# EAGLE design pid driver (EAGLE 9.5.1)

## Sheet 1 of 2
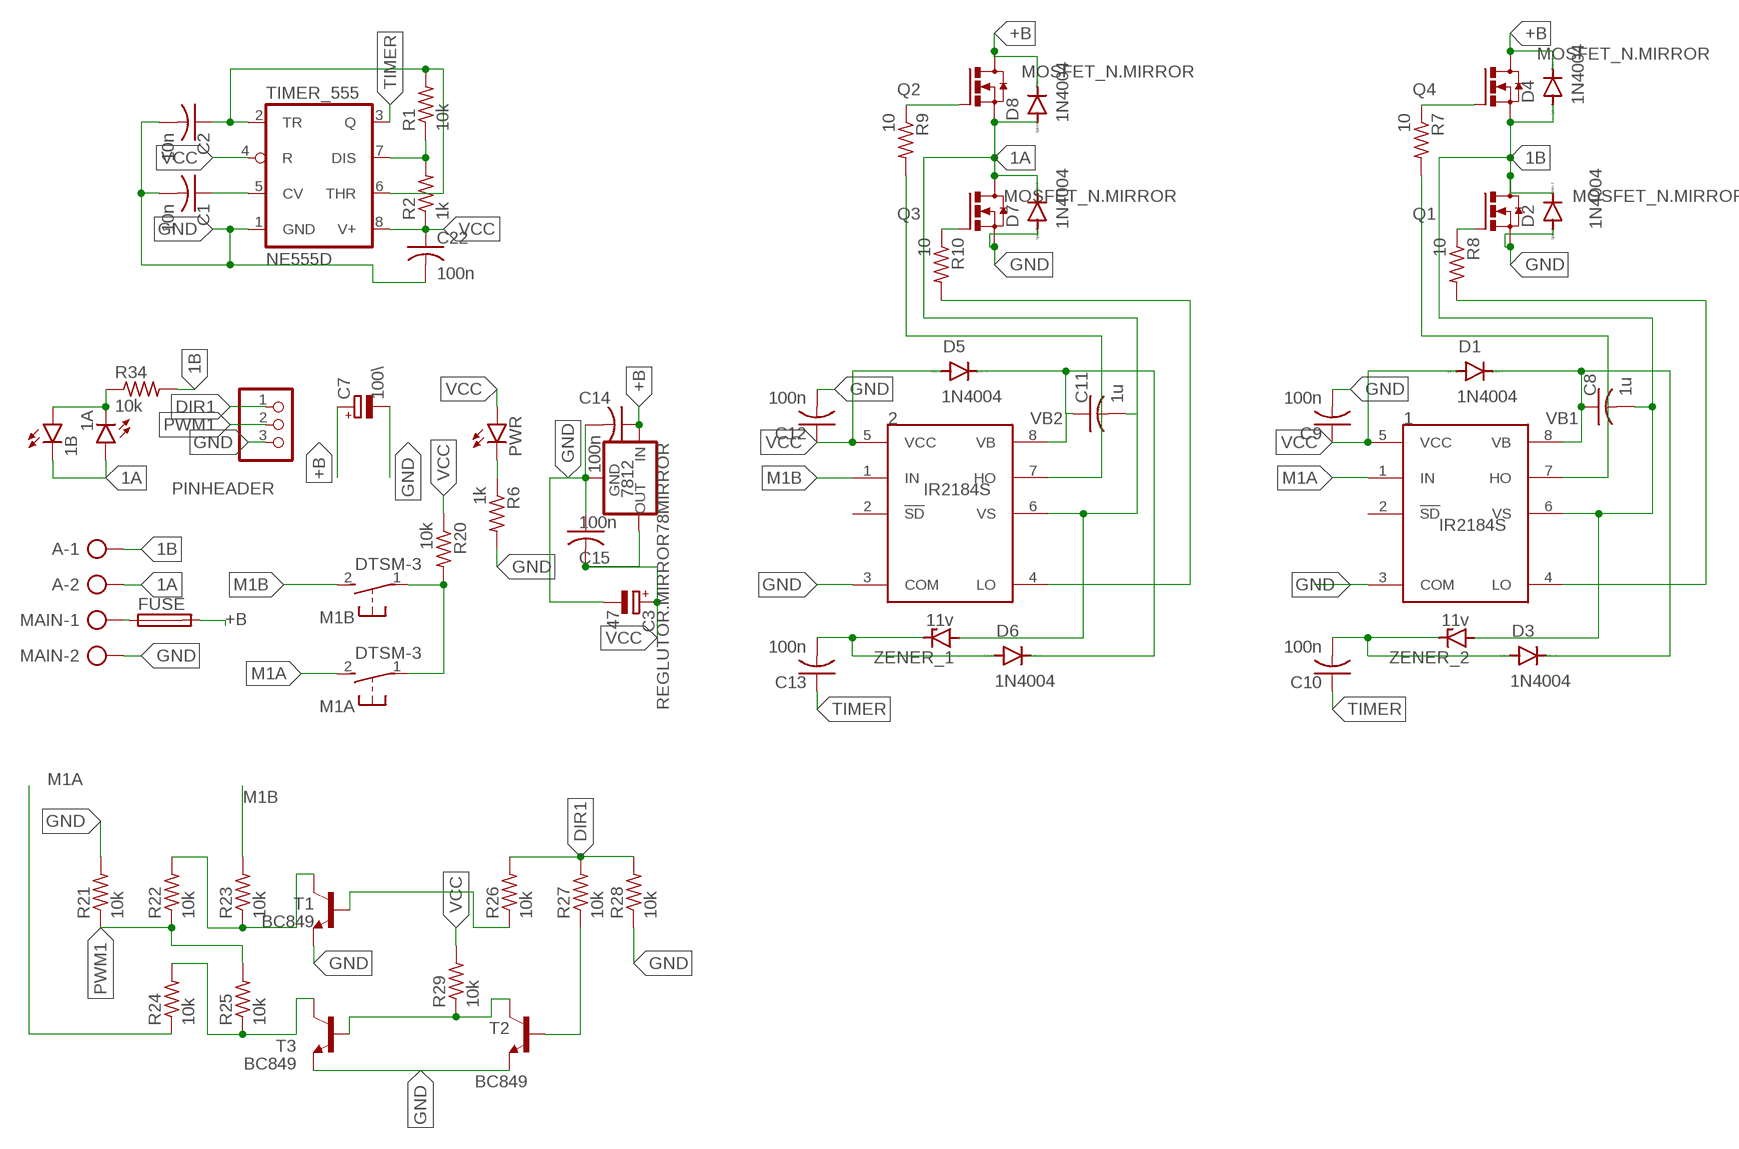
[diagram p0: schematic, sheet 1]

### Parts
1  IR2184S  [SO08]
1A  LEDCHIPLED_1206  [CHIPLED_1206]
1B  LEDCHIPLED_1206  [CHIPLED_1206]
2  IR2184S  [SO08]
7812  REGLUTOR.MIRROR78MIRROR  [78MIRROR]
A  AK300/22  [XTALRR488W60L1090T465H350B]
C1  10n  C-USC1206K  [C1206K]
C2  10n  C-USC1206K  [C1206K]
C3  47  CPOL-EUE5-10.5  [E5-10,5]
C7  100\  CPOL-EUE5-10.5  [E5-10,5]
C8  1u  C-USC1206K  [C1206K]
C9  100n  C-USC1206K  [C1206K]
C10  100n  C-USC1206K  [C1206K]
C11  1u  C-USC1206K  [C1206K]
C12  100n  C-USC1206K  [C1206K]
C13  100n  C-USC1206K  [C1206K]
C14  100n  C-USC1206K  [C1206K]
C15  100n  C-USC1206K  [C1206K]
C22  100n  C-USC1206K  [C1206K]
D1  1N4004  [DO41-10]
D2  1N4004  [DO41-10]
D3  1N4004  [DO41-10]
D4  1N4004  [DO41-10]
D5  1N4004  [DO41-10]
D6  1N4004  [DO41-10]
D7  1N4004  [DO41-10]
D8  1N4004  [DO41-10]
FUSE  FUSE_HOLDER  [SH22,5A]
M1A  DTSM-3  [DTSM-3]
M1B  DTSM-3  [DTSM-3]
MAIN  AK300/22  [XTALRR488W60L1090T465H350B]
PINHEADER  PINHD-1X3  [1X03]
PWR  LEDCHIPLED_1206  [CHIPLED_1206]
Q1  MOSFET_N.MIRROR  [TO220.MIRROR]
Q2  MOSFET_N.MIRROR  [TO220.MIRROR]
Q3  MOSFET_N.MIRROR  [TO220.MIRROR]
Q4  MOSFET_N.MIRROR  [TO220.MIRROR]
R1  10k  R-US_M1206  [M1206]
R2  1k  R-US_M1206  [M1206]
R6  1k  R-US_M1206  [M1206]
R7  10  R-US_M1206  [M1206]
R8  10  R-US_M1206  [M1206]
R9  10  R-US_M1206  [M1206]
R10  10  R-US_M1206  [M1206]
R20  10k  R-US_M1206  [M1206]
R21  10k  R-US_R1206  [R1206]
R22  10k  R-US_R1206  [R1206]
R23  10k  R-US_R1206  [R1206]
R24  10k  R-US_R1206  [R1206]
R25  10k  R-US_R1206  [R1206]
R26  10k  R-US_R1206  [R1206]
R27  10k  R-US_R1206  [R1206]
R28  10k  R-US_R1206  [R1206]
R29  10k  R-US_R1206  [R1206]
R34  10k  R-US_M1206  [M1206]
T1  BC849  [SOT23]
T2  BC849  [SOT23]
T3  BC849  [SOT23]
TIMER_555  NE555D  [SO08]
ZENER_1  11v  BZD23  [SOD81]
ZENER_2  11v  BZD23  [SOD81]

### Nets
1A: 1A.A 1B.C 2.6(VS) A.2 C11.2 D7.C D8.A Q2.S Q3.D ZENER_1.A
1B: 1.6(VS) A.1 C8.2 D2.C D4.A Q1.D Q4.S R34.2 ZENER_2.A
+B: 7812.IN C7.+ C14.1 D4.C D8.C FUSE.2 Q2.D Q4.D
DIR1: PINHEADER.1 R26.2 R27.2 R28.2
GND: 1.3(COM) 2.3(COM) 7812.GND C1.2 C2.2 C3.- C7.- C9.2 C12.2 C14.2 C15.1 C22.2 D2.A D7.A MAIN.2 PINHEADER.3 Q1.S Q3.S R6.2 R21.2 R28.1 T1.2(E) T2.2(E) T3.2(E) TIMER_555.1(GND)
M1A: 1.1(IN) M1A.2 R24.1
M1B: 2.1(IN) M1B.2 R23.2
N$1: PWR.C R6.1
N$2: C1.1 TIMER_555.5(CV)
N$3: R1.1 R2.2 TIMER_555.7(DIS)
N$4: C2.1 R1.2 TIMER_555.2(TR) TIMER_555.6(THR)
N$7: M1A.1 M1B.1 R20.2
N$9: Q4.G R7.1
N$10: Q1.G R8.1
N$12: 1.4(LO) R8.2
N$13: 1.7(HO) R7.2
N$14: C10.2 D3.A ZENER_2.C
N$15: Q3.G R10.1
N$16: Q2.G R9.1
N$17: 2.4(LO) R10.2
N$18: 2.7(HO) R9.2
N$20: C13.2 D6.A ZENER_1.C
N$22: FUSE.1 MAIN.1
N$24: R24.2 R25.1 T3.3(C)
N$25: R22.2 R23.1 T1.3(C)
N$26: R26.1 T1.1(B)
N$27: R29.1 T2.3(C) T3.1(B)
N$28: R27.1 T2.1(B)
N$45: 1A.C 1B.A R34.1
PWM1: PINHEADER.2 R21.1 R22.1 R25.2
TIMER: C10.1 C13.1 TIMER_555.3(Q)
VB1: 1.8(VB) C8.1 D1.C D3.C
VB2: 2.8(VB) C11.1 D5.C D6.C
VCC: 1.5(VCC) 2.5(VCC) 7812.OUT C3.+ C9.1 C12.1 C15.2 C22.1 D1.A D5.A PWR.A R2.1 R20.1 R29.2 TIMER_555.4(R) TIMER_555.8(V+)
Unconnected: 1.2(!SD) 2.2(!SD)

## Sheet 2 of 2

## Library data of the parts
1 2 = irs:IR2184
1A 1B PWR = led:LED: LED OSRAM: - CHIPLED LG R971, LG N971, LY N971, LG Q971, LY Q971, LO R971, LY R971 LH N974, LH R974 LS Q976, LO Q976, LY Q976 LO Q996 - Hyper CHIPLED LW Q18S LB Q993, LB Q99A, LB R99A - SideLED LS A670, LO A670, LY A670, LG A670, LP A670 LB A673, LV A673, LT A673, LW A673 LH A674 LY A675 LS A676, LA A676, LO A676, LY A676, LW A676 LS A679, LY A679, LG A679 - Hyper Micro SIDELED® LS Y876, LA Y876, LO Y876, LY Y876 LT Y87S - SmartLED LW L88C, LW L88S LB L89C, LB L89S, LG L890 LS L89K, LO L89K, LY L89K LS L896, LA L896, LO L896, LY L896 - TOPLED LS T670, LO T670, LY T670, LG T670, LP T670 LSG T670, LSP T670, LSY T670, LOP T670, LYG T670 LG T671, LOG T671, LSG T671 LB T673, LV T673, LT T673, LW T673 LH T674 LS T676, LA T676, LO T676, LY T676, LB T676, LH T676, LSB T676, LW T676 LB T67C, LV T67C, LT T67C, LS T67K, LO T67K, LY T67K, LW E67C LS E67B, LA E67B, LO E67B, LY E67B, LB E67C, LV E67C, LT E67C LW T67C LS T679, LY T679, LG T679 LS T770, LO T770, LY T770, LG T770, LP T770 LB T773, LV T773, LT T773, LW T773 LH T774 LS E675, LA E675, LY E675, LS T675 LS T776, LA T776, LO T776, LY T776, LB T776 LHGB T686 LT T68C, LB T68C - Hyper Mini TOPLED® LB M676 - Mini TOPLED Santana® LG M470 LS M47K, LO M47K, LY M47K Source: http://www.osram.convergy.de LUXEON: - LUMILED® LXK2-PW12-R00, LXK2-PW12-S00, LXK2-PW14-U00, LXK2-PW14-V00 LXK2-PM12-R00, LXK2-PM12-S00, LXK2-PM14-U00 LXK2-PE12-Q00, LXK2-PE12-R00, LXK2-PE12-S00, LXK2-PE14-T00, LXK2-PE14-U00 LXK2-PB12-K00, LXK2-PB12-L00, LXK2-PB12-M00, LXK2-PB14-N00, LXK2-PB14-P00, LXK2-PB14-Q00 LXK2-PR12-L00, LXK2-PR12-M00, LXK2-PR14-Q00, LXK2-PR14-R00 LXK2-PD12-Q00, LXK2-PD12-R00, LXK2-PD12-S00 LXK2-PH12-R00, LXK2-PH12-S00 LXK2-PL12-P00, LXK2-PL12-Q00, LXK2-PL12-R00 Source: www.luxeon.com KINGBRIGHT: KA-3528ASYC Source: www.kingbright.com
7812 = MOSFET MIRROR:REGLUTOR.MIRROR
A MAIN = con-ptr50056:AK300/2: CONNECTOR
C1 C2 C8-C15 C22 = rcl:C-US: CAPACITOR, American symbol; SPICEPREFIX: C
C3 C7 = rcl8:CPOL-EU: POLARIZED CAPACITOR, European symbol; SPICEPREFIX: C
D1-D8 = diode:1N4004: DIODE general purpose rectifier, 1 A
FUSE = MIA_LIBRARY (2):FUSE_HOLDER
M1A M1B = switch-tact:DTSM-3
PINHEADER = pinhead:PINHD-1X3: PIN HEADER
Q1-Q4 = MIA_LIBRARY (5):MOSFET_N.MIRROR
R1 R2 R6-R10 R20-R29 R34 = rcl:R-US_: RESISTOR, American symbol; SPICEPREFIX: R
T1-T3 = transistor-neu-to92:BC849: NPN TRANSISTOR
TIMER_555 = linear:*555: TIMER
ZENER_1 ZENER_2 = diode:BZD23: Z DIODE

## Board
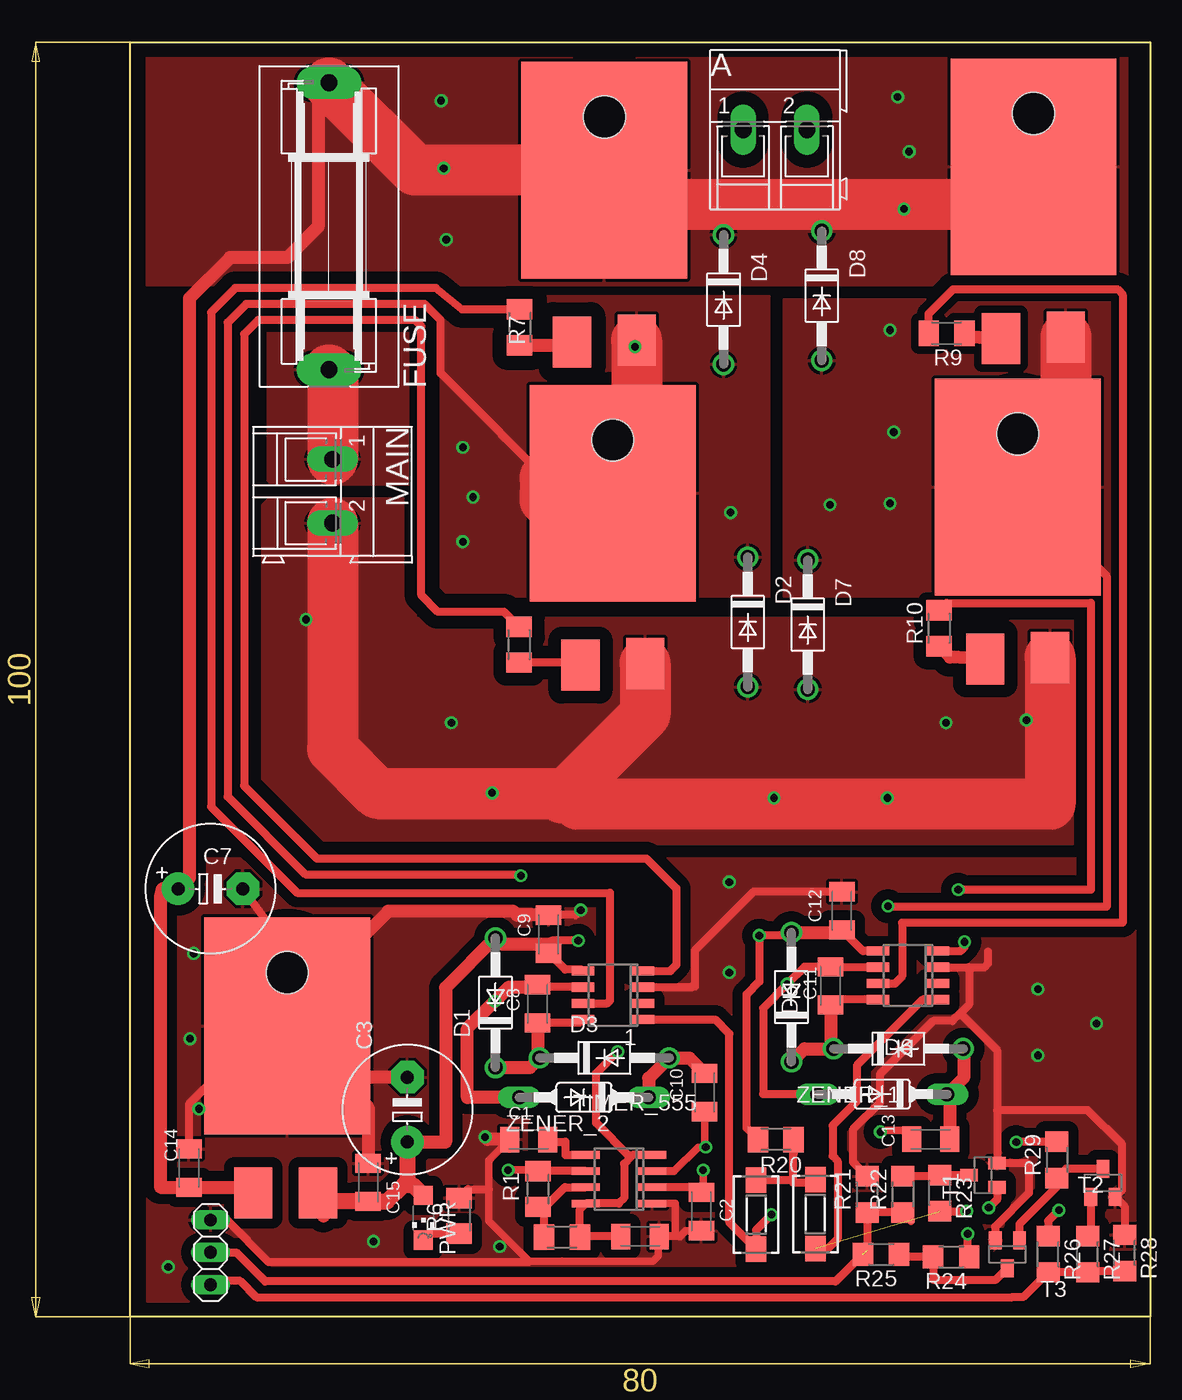
[diagram p1: board, top side]
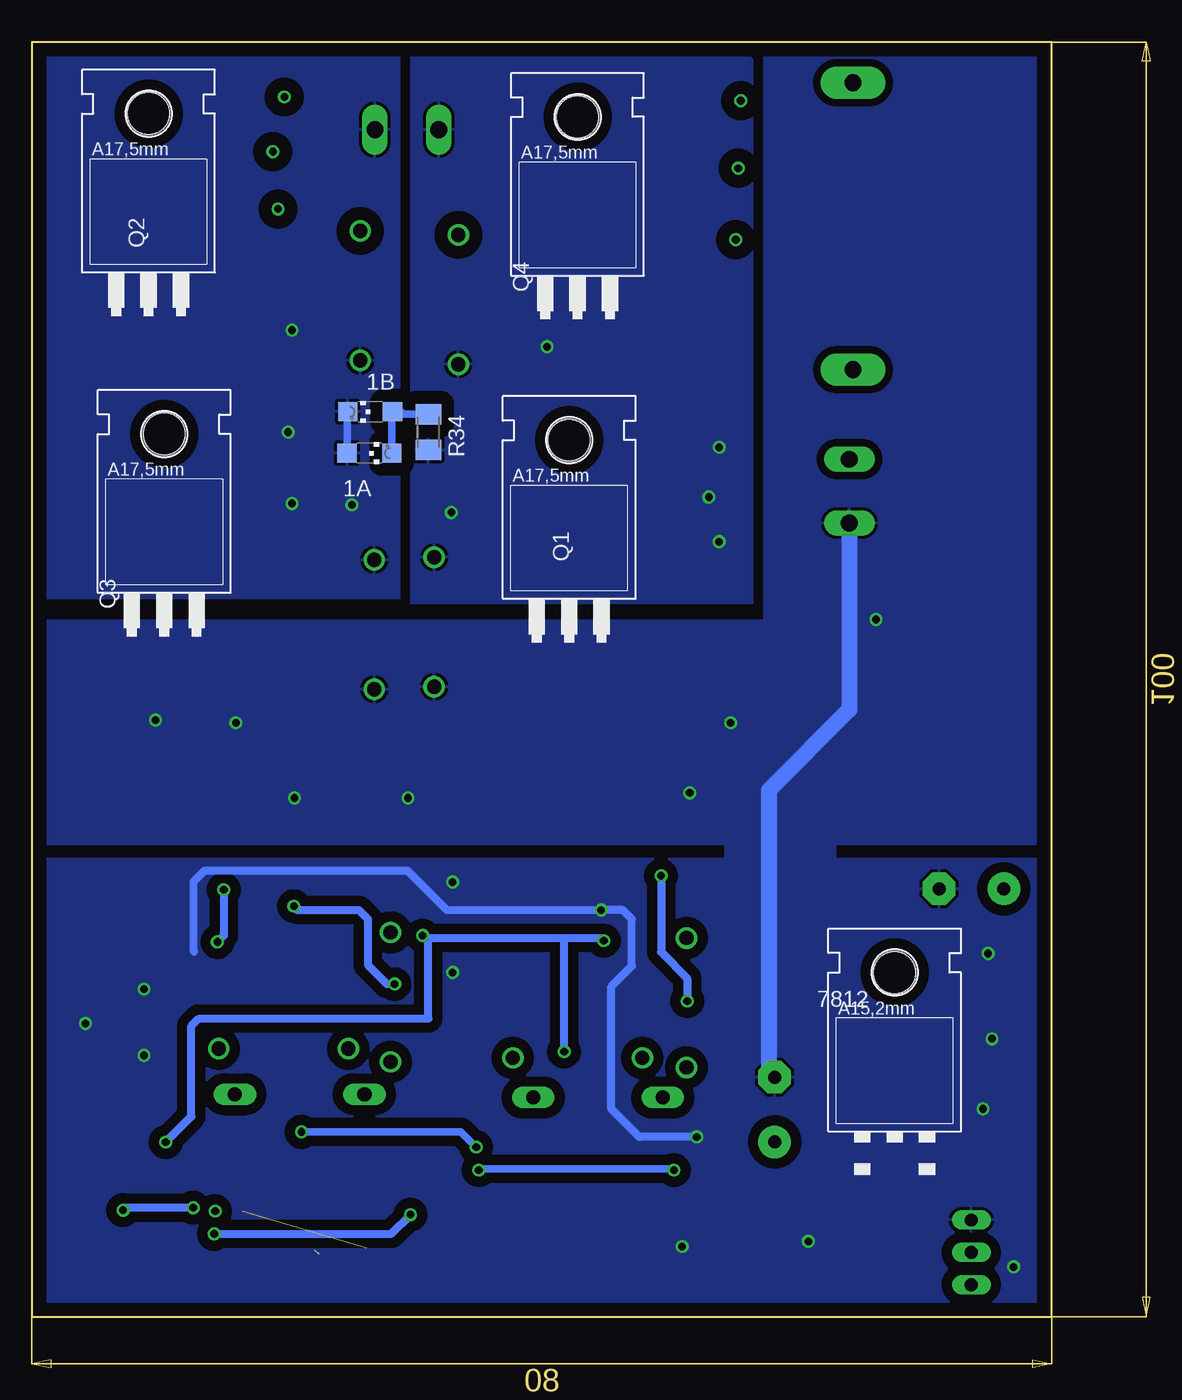
[diagram p2: board, bottom side, seen from below]

Size 80 x 100 mm. Coordinates in mm from the lower left corner, seen from the top.
Outline: 0,0 0,100 80,100 80,0 0,0
Copper layers (1*16): Top 0.035mm / dielectric 1.5mm / Bottom 0.035mm
Design rules "default *": minimum track width 0.015240625mm, minimum drill 0.8mm, track to track 0.6mm, track to pad 0.6mm, pad to pad 0.4mm, via to via 6mil, smd to smd 6mil, copper to edge 40mil, drill to drill 6mil, minimum pad ring 10mil, minimum via ring 8mil, stop-mask expansion 4mil, vias tented up to drill 0mil, thermal gap 10mil

### Footprints (pad centres in the part's own frame; a part is rotated, then mirrored left to right if it is on the bottom)
SO08 = smd 0.72 x 1.78: 1 -1.905,-2.35; 2 -0.635,-2.35; 3 0.635,-2.35; 4 1.905,-2.35; 5 1.905,2.35; 6 0.635,2.35; 7 -0.635,2.35; 8 -1.905,2.35
CHIPLED_1206 = smd 1.5 x 1.5: A 0,-1.75; C 0,1.75
78MIRROR = smd 13 x 17 bottom: GND 0,8.27 | smd 3 x 4 bottom: IN 2.667,-4.826; OUT -2.413,-4.826 | hole 3.302: 0,12.446
XTALRR488W60L1090T465H350B = drill 1.321 long: 1 -2.515,-1.27; 2 2.489,-1.27
C1206K = smd 1.5 x 2: 1 -1.5,0; 2 1.5,0
E5-10,5 = drill 1.016 pad 2.54: + -2.54,0 | drill 1.016 pad 2.54 octagon: - 2.54,0
DO41-10 = drill 1.118: A 5.08,0; C -5.08,0
SH22,5A = drill 1.321 pad 2.54 long: 1 -11.252,0; 2 11.252,0
DTSM-3 = smd 2 x 1.6: 1 -2.7,0; 2 2.7,0
1X03 = drill 1.016 long: 1 -2.54,0; 2 0,0; 3 2.54,0
TO220.MIRROR = smd 13 x 17 bottom: D 0,7 | smd 3 x 4 bottom: G 2.54,-6.477; S -2.54,-6.35 | hole 3.302: 0,11.176
M1206 = smd 1.6 x 2: 1 -1.4,0; 2 1.4,0
R1206 = smd 1.6 x 1.803: 1 -1.422,0; 2 1.422,0
SOT23 = smd 1 x 1.4: 1 -0.95,-1.1; 2 0.95,-1.1; 3 0,1.1
SO08' = smd 0.6 x 2.2: 1 -1.905,-2.6; 2 -0.635,-2.6; 3 0.635,-2.6; 4 1.905,-2.6; 5 1.905,2.6; 6 0.635,2.6; 7 -0.635,2.6; 8 -1.905,2.6
SOD81 = drill 1.118 long: A 5.08,0; C -5.08,0

### Placement (x,y rotation side)
1  37.87,25.22 90 top
1A  53.53,67.75 270 bottom
1B  53.47,71 90 bottom
2  61.01,26.78 90 top
7812  12.33,14.55 0 bottom
A  50.6,94.4 0 top
C1  31.27,13.9 180 top
C2  44.8,8.25 270 top
C3  21.75,16.25 90 top
C7  6.31,33.57 0 top
C8  31.96,24.55 90 top
C9  32.82,30 90 top
C10  45.07,17.59 90 top
C11  54.94,25.95 90 top
C12  55.83,31.84 90 top
C13  62.8,13.92 0 top
C14  4.62,11.66 90 top
C15  18.67,10.54 270 top
C22  40,6.3 0 top
D1  28.66,24.63 90 top
D2  48.45,54.5 270 top
D3  37.2,20.3 0 top
D4  46.55,79.8 270 top
D5  51.87,25.07 90 top
D6  60.26,21.02 0 top
D7  53.15,54.3 270 top
D8  54.25,80.1 270 top
FUSE  15.6,85.55 90 top
M1A  49.1,8 270 top
M1B  53.75,8.05 270 top
MAIN  17.15,64.75 270 top
PINHEADER  6.31,5.04 90 top
PWR  23,7.76 180 top
Q1  37.86,57.6 0 bottom
Q2  70.85,83.21 0 bottom
Q3  69.62,58.08 0 bottom
Q4  37.2,82.95 0 bottom
R1  31.98,10.02 90 top
R2  33.88,6.26 180 top
R6  25.81,7.91 90 top
R7  30.56,77.62 90 top
R8  30.51,52.72 90 top
R9  64.04,77.16 180.1 top
R10  63.45,54.01 90 top
R20  50.65,13.91 0 top
R21  57.8,9.6 90 top
R22  60.6,9.6 90 top
R23  63.5,9.7 270 top
R24  64.4,4.7 180 top
R25  58.9,4.9 180 top
R26  72,4.9 270 top
R27  75.1,4.9 270 top
R28  78,5 270 top
R29  72.7,12.3 90 top
R34  48.9,69.4 270 bottom
T1  66.9,11.1 90 top
T2  76.3,10.5 0 top
T3  68.8,4.9 180 top
TIMER_555  NE555D  [SO08']  38.35,10.79 90 top
ZENER_1  59,17.45 180 top
ZENER_2  35.6,17.2 180 top

### Tracks (layer width: path | path; a pad name or v marks a point on that pad's centre or on a via)
1A  (via drill 0.6)
  Top 0.61: 2.6 54.98,27.41 C11.2 52.9,27.45 v51.55,26.1 49.65,24.2 49.65,17.45 ZENER_1.A | 71.35,65.6 71.35,63.35 71.35,59.1 | Q3.D 76.6,58.1 76.6,32.15 59.5,32.15 v59.45,32.2
  Top 4: 71.35,62.9 72.45,62.9 72.45,65.6 71.35,65.6 | 71.35,63.35 Q3.D 68.05,63.51 68.05,61.7 | 71.35,66 71.35,62.9 | Q2.S 73.39,64.94 71.35,62.9
  Bottom 0.6: 1A.A 55.28,70.94 1B.C
  Bottom 0.61: v59.45,32.2 59.15,31.9 54.35,31.9 53.65,31.2 53.65,27.6 52.15,26.1 v51.55,26.1
  other vias: 59.6,63.8 59.6,77.4 54.9,63.7 59.9,69.4
  pour Top (isolate 0.61): 78.95,79.8 51.25,79.8 51.25,56.5 78.95,56.5
  pour Bottom (isolate 1.016): 51.15,56.4 51.15,99.2 78.95,99.2 78.95,56.4
1B  (via drill 0.6)
  Top 0.61: 1.6 32.16,25.86 C8.2 | Q1.D 33.76,64.6 24.35,74.01 24.35,78.2 23.1,79.45 9.1,79.45 7.65,78 7.65,40.8 13.75,34.7 30.65,34.7 v30.65,34.6
  Top 1.016: ZENER_2.A 26.45,17.2 26.45,22.6 v28.6,24.75 29.7,25.86 32.16,25.86
  Top 4: Q4.S 39.74,70.89 32.75,63.9 32.55,64.1 32.55,64.6 | Q1.D 32.55,64.6 | 32.55,65.8 32.55,64.6
  Bottom 0.61: v28.6,24.75 28.6,26.55 30.65,28.6 v30.65,34.6
  other vias: 39.6,76.1 26.1,68.2 26.9,64.3 26.1,60.8 47.1,63.1
  pour Top (isolate 1.13): 50.15,80.1 50.15,56.45 24.1,56.45 23.65,56 23.65,79.6 23.15,80.1
  pour Bottom (isolate 1.016): 50.3,56 23.45,56 23.45,98.6 23.85,99 50.3,99
+B  (via drill 0.6)
  Top 0.61: Q2.D 67.3,93.76 67.3,95.1 | Q2.D 68.86,92.2 67.3,92.2 | Q2.D 70.85,91.05 68.5,88.7 | Q2.D 70.4,89.76 70.4,88.7 | 73.7,88.5 72.56,88.5 Q2.D
  Top 1.016: 7812.IN 9.79,10.16 C14.1 2.38,10.16 2.38,32.95 2.52,33.52 2.57,33.57 C7.+ 4.65,34.45 4.65,79.9 7.85,83.1 12.35,83.1 14.75,85.5 14.75,95.95 FUSE.2
  Top 4: Q2.D 67.94,87.3 39.85,87.3 Q4.D 22.35,89.95 15.6,96.7 FUSE.2
  other vias: 24.4,95.4 24.6,90.1 24.8,84.5 61.1,91.4 60.2,95.7
  pour Top (isolate 1.016): 78.2,99.2 78.2,81 78.1,80.9 1.3,80.9 1.3,99.2
DIR1
  Top 0.61: PINHEADER.1 6.31,2.6 6.51,2.8 8.64,2.8 9.91,1.53 69.2,1.53 70.05,1.53 R26.2 R27.2 75.2,3.58 R28.2
GND  (via drill 0.6, 0.6 pad 0.6)
  Top 0.6: C1.2 28.15,12.28 28.15,10 28.15,7.5 31.3,4.35 41,4.35 41.42,4.78 41.42,6.38 41.42,6.47 | TIMER_555.1 42.75,8.88 42.75,6.3 C22.2 | C2.2 43.6,6.75 43.15,6.3
  Top 0.61: 67.3,28.65 67.3,27.7 67.02,27.41 65.8,27.41 | C12.2 48.89,33.34 44.3,28.75 44.3,26.1 | 44.3,26.1 44.3,25.9 | v35.35,31.9 34.95,31.5 C9.2 | 41.45,6.45 41.42,6.47 | 41.42,6.38 C22.2 43.15,6.3 | R6.2 26.5,10 28.15,10 | 20.25,31.8 12.33,23.88 7812.GND 12.33,28.77 C7.- | 11.12,23.14 4.62,16.64 C14.2 | PINHEADER.3 7.57,7.58 10.85,4.3 31.25,4.3 31.3,4.35 | 44.3,26.1 44.05,25.86 1.3 | 2.3 65.8,27.41 | 65.8,27.41 65.8,24.5 65.1,23.8 | 65.1,23.8 64.5,23.2 63,23.2 58.8,19 58.8,16.79 56.7,14.69 56.7,12.71 56.71,12.7 56.71,12.11 R21.2 56.91,11.91 | 65.1,23.8 68,20.9 68,16.2 | 68,16.2 T1.2 70.34,12.05 70.49,11.9 70.49,9.7 67.85,7.06 T3.2 | R28.1 78,8.65 T2.2 77.8,9.95 77.8,13.5 75.1,16.2 68,16.2
  Top 1.016: C1.2 28.05,13.9 v27.85,14.1 | 7812.GND 15.09,18.79 16.29,18.79 | 16.29,18.79 18.67,16.41 C15.1 | C3.- 16.29,18.79 | C9.2 30.35,31.5 30.05,31.8 20.25,31.8 11.59,23.14 11.12,23.14
  Top 4: Q1.S 40.4,47.25 34.2,41.05 | 34.2,41.05 34.1,40.95 | 34.1,40.95 33.85,40.7 | Q3.S 72.16,40.2 35.15,40.2 34.4,40.95 34.1,40.95 | MAIN.2 15.88,44.57 19.4,41.05 34.2,41.05
  Bottom 0.61: 67.3,28.65 67.3,34.15 66.45,35 50.55,35 47.45,31.9 v35.35,31.9 33.65,31.9 32.95,31.2 32.95,27.5 34.55,25.9 34.55,16.3 32.35,14.1 v27.85,14.1
  Bottom 1.27: MAIN.2 15.88,47.62 22.2,41.3 22.2,18.3
  other vias: 13.8,54.7 25.2,46.6 28.4,41.1 64,46.6 50.5,40.7 70.3,46.8 59.4,40.7 47,34.1 47,27 29,5.5 19.1,5.9 3,3.9 5.4,16.3 4.7,21.8 5,28.5 71.2,20.5 75.8,23 71.2,25.7
  pour Top (isolate 1.016): 75.17,54.4 74.78,54.8 22.45,54.8 22.45,63.9 22.15,64.2 10.85,64.2 8.85,62.2 8.85,39.4 11.15,37.1 76.47,37.1 76.47,53.4 75.47,54.4
  pour Bottom: 79.15,54.6 79.15,37.1 1.25,37.1 1.25,98.8 22.55,98.8 22.55,54.6
  pour Bottom (isolate 0.813): 79.45,35.9 79.45,0.8 1.25,0.8 1.25,35.9
  pour Bottom: 11.05,64 21.05,64 21.55,63.5 21.55,51.6 25.65,47.5 25.65,18.9 24.05,17.3 18.05,17.3 16.95,18.4 16.95,42.9 11.05,48.8
  pour Top (isolate 0.813): 79.03,0.8 1.35,0.8 1.35,36 79.83,36
M1A  (via drill 0.6, 0.6 pad 0.6)
  Top 0.61: 1.1 45.88,23.32 47,22.2 47,7.4 M1A.2 49.1,6.8 v50.3,8 | R24.1 65.7,4.82 v65.7,6.5
  Bottom 0.61: v65.7,6.5 51.8,6.5 v50.3,8
M1B  (via drill 0.6)  (1 unrouted)
  Top 0.61: R23.2 v65.62,8.28 65.7,8.2 | 2.1 62.17,24.88 57,19.7 57,16.9 55.1,15 55.1,12.6 55.5,12.2 55.5,6.1 54.75,5.35 M1B.2
N$1
  Top 0.61: R6.1 23.5,6.51 PWR.C
N$2
  Top 0.61: C1.1 32.95,13.72 34.15,13.72 34.15,12.7 TIMER_555.5
N$3
  Top 0.61: TIMER_555.7 34.1,10.15 32.57,8.62 R1.1 32.48,8.12 R2.2
N$4  (via drill 0.6)
  Top 0.6: v44.95,11.5 44.95,9.9 C2.1 | v29.65,11.5 31.91,11.5 R1.2
  Top 0.61: C2.1 44.4,10.15 TIMER_555.2 | 32.04,11.36 R1.2 TIMER_555.6
  Bottom 0.6: v29.65,11.5 29.75,11.6 44.85,11.6 v44.95,11.5
N$7
  Top 0.61: 53.25,10.25 M1B.1 53.5,10.5 52,10.5 52,10.7 | 52.05,12.75 R20.2 52,13.86 52,10.7 | 52,10.7 M1A.1
N$9
  Top 1.016: Q4.G 34.36,76.22 R7.1
N$10
  Top 0.61: Q1.G 34.88,51.32 R8.1
N$12
  Top 0.61: 1.4 42.38,27.12 42.85,27.6 42.85,33.6 40.5,35.95 14.65,35.95 8.95,41.65 8.95,77.1 10.05,78.2 22.35,78.2 22.85,77.7 22.85,56.6 24.15,55.3 29.33,55.3 R8.2
N$13
  Top 0.61: 1.7 37.44,24.59 37.65,24.8 37.65,33.25 13.1,33.25 6.35,40 6.35,78.8 8.25,80.7 23.98,80.7 26.05,79.02 R7.2
N$14
  Top 1.016: ZENER_2.C 40.68,18.7 D3.A 43.86,20.3 C10.2
N$15
  Top 1.016: Q3.G 64.32,51.74 R10.1
N$16
  Top 1.016: R9.1 65.74,76.86 Q2.G
N$17  (via drill 0.6)
  Top 0.61: R10.2 64.04,56 75.35,56 75.35,33.5 v64.95,33.5 | 2.4 65.14,28.68 65.45,29 v65.45,29.4
  Bottom 0.61: v64.95,33.5 64.95,29.9 v65.45,29.4
N$18
  Top 0.61: 2.7 59.99,26.14 60.55,26.7 60.55,30.9 77.85,30.9 77.85,80.2 77.45,80.6 64.55,80.6 62.64,78.69 R9.2
N$20
  Top 1.016: D6.A 65.38,20.98 65.38,18.75 ZENER_1.C 64.3,17.23 C13.2
N$22
  Top 4: FUSE.1 15.88,74.02 MAIN.1
  pour Top: 11.05,65.3 22.05,65.3 22.15,65.4 22.15,77.5 10.95,77.5 10.75,77.3 10.75,65.6
N$24
  Top 0.61: R24.2 60.52,4.7 R25.1 | 62.7,4.42 R24.2 | T3.3 67.9,2.9 63,2.9 62.98,2.92 R24.2
N$25
  Top 0.61: R22.2 63.4,11.02 R23.1 63.52,11.1 T1.3
N$26  (via drill 0.6)
  Top 0.61: 71.7,6.62 R26.1 72,7.51 v72.85,8.35 | T1.1 68,9.2 v67.35,8.55
  Bottom 0.61: v67.35,8.55 72.65,8.55 v72.85,8.35
N$27
  Top 0.61: T3.1 69.75,7.25 72.7,10.2 R29.1 73.42,11.6 T2.3
N$28
  Top 0.61: T2.1 75.35,6.57 R27.1
N$31  (via drill 0.6)
  other vias: 60.7,86.9
N$45
  Bottom 0.6: 1A.C 51.78,70.94 1B.A 51.52,71.2 51.25,71.2 50.85,70.8 R34.1
PWM1  (1 unrouted)
  Top 0.61: PINHEADER.2 8.31,5.04 10.59,2.76 55.34,2.76 R25.2 | 61.26,7.52 R22.1 R21.1 57.8,5.22
TIMER  (via drill 0.6)
  Top 0.6: C10.1 45.07,13.3 v45.15,13.3 44.55,13.3 42.67,11.43 | C13.1 60.6,14.62 58.85,14.62 v58.85,14.5
  Top 0.61: TIMER_555.3 42.67,11.43
  Bottom 0.6: v58.85,14.5 46.35,14.5 v45.15,13.3
VB1
  Top 0.61: 1.8 35.26,23.05 C8.1
  Top 1.016: D1.C 31.37,19.55 D3.C 31.96,20.46 C8.1
VB2
  Top 0.61: 2.8 55.37,24.88 C11.1
  Top 1.016: C11.1 54.94,21 D6.C 52.9,21.02 D5.C
VCC  (via drill 0.6)
  Top 0.61: 2.5 57.48,28.68 56.01,30.16 | 56.01,30.16 C12.1 | 56,30.15 56.01,30.16 | 1.5 35.42,27.23 34.12,27.23 32.84,28.5 C9.1 | v35.15,29.5 33.1,29.5 32.81,29.21 | D5.A 51.62,29.9 v49.35,29.9 49.35,26.3 48.35,25.3 48.35,14.81 R20.1 | TIMER_555.4 40.91,12.73 39.48,12.73 39.25,12.5 | 39.25,12.5 38.75,12.01 38.75,9.3 38.34,8.88 TIMER_555.8 35.28,8.41 R2.1 35.32,6.3 C22.1 | 39.25,12.5 36.55,15.2 36.55,19.1 v38.25,20.8 | R29.2 69.52,13.72 v69.5,13.7
  Top 1.016: D5.A 56,30.15 | D1.A 28.86,29.51 | 32.81,29.21 32.11,29.21 | 32.11,29.21 29.16,29.21 D1.A | 32.11,29.21 C9.1 | D1.A 24.75,25.8 24.75,13.7 C3.+ | 7812.OUT 15.17,7.9
  Top 1.27: 7812.OUT 15.43,9.04 C15.2 20.15,9.04 21.45,10.34 | 21.45,10.34 22.17,10.34 PWR.A | C3.+ 21.75,10.64 21.45,10.34
  Bottom 0.61: 38.15,29.7 49.15,29.7 v49.35,29.9 48.9,29.45 48.9,23.4 66.9,23.4 67.5,22.8 67.5,15.7 v69.5,13.7 | 38.15,29.7 35.35,29.7 v35.15,29.5 | v38.25,20.8 38.25,29.6 38.15,29.7